# EAGLE design pulse (EAGLE 7.5.0)
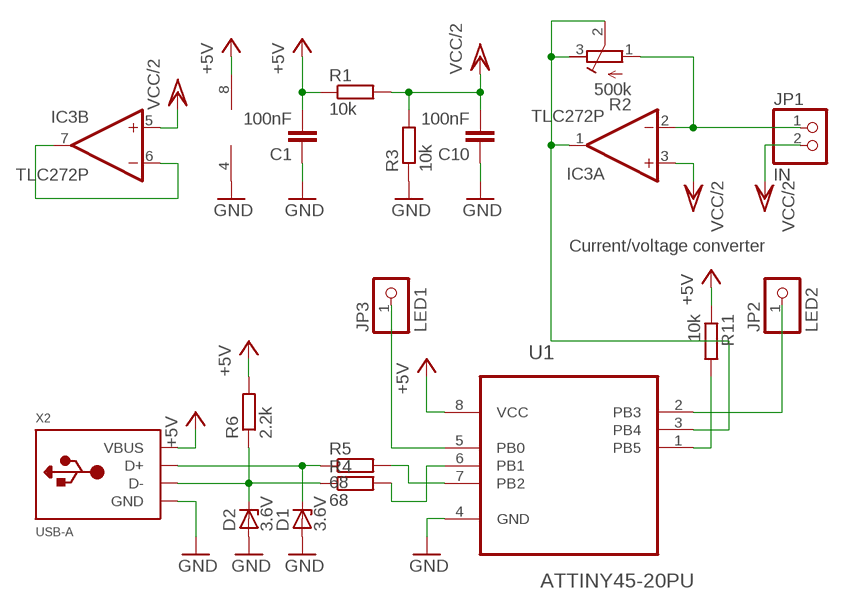
[diagram p0: schematic, sheet 1]

## Parts
C1  100nF  C-EU075-032X103  [C075-032X103]
C10  100nF  C-EU050-025X075  [C050-025X075]
D1  3.6V  ZENER-DIODEZD-2.5  [ZDIO-2.5]
D2  3.6V  ZENER-DIODEZD-5  [ZDIO-5]
IC3  TLC272P  [DIL08]
JP1  IN  PINHD-1X2  [1X02]
JP2  LED2  PINHD-1X1  [1X01]
JP3  LED1  PINHD-1X1  [1X01]
R1  10k  R-EU_0207/12  [0207/12]
R2  500k  R-TRIMM64W  [RTRIM64W]
R3  10k  R-EU_0204/2V  [0204V]
R4  68  R-EU_0204/2V  [0204V]
R5  68  R-EU_0204/2V  [0204V]
R6  2.2k  R-EU_0204/2V  [0204V]
R11  10k  R-EU_0204/7  [0204/7]
U1  ATTINY45-20PU  [DIP254P762X533-8]
X2  USB-A  [MOLEX_480371000]

## Nets
+5V: C1.2 IC3.8(P:V+) R1.1 R6.2 R11.1 U1.8(VCC) X2.1(VBUS)
GND: C1.1 C10.1 D1.A D2.A IC3.4(P:V-) R3.1 U1.4(GND) X2.4(GND)
N$1: IC3.2(A:-IN) JP1.1 R2.1(A)
N$2: R5.2 U1.7(PB2)
N$3: R4.2 U1.6(PB1)
N$4: JP2.1 U1.2(PB3)
N$5: JP3.1 U1.5(PB0)
N$7: IC3.6(B:-IN) IC3.7(B:OUT)
N$8: IC3.1(A:OUT) R2.2(S) R2.3(E) U1.3(PB4)
N$9: R11.2 U1.1(PB5)
N$10: D1.C R5.1 X2.3(D+)
N$11: D2.C R4.1 R6.1 X2.2(D-)
VCC/2: C10.2 IC3.3(A:+IN) IC3.5(B:+IN) JP1.2 R1.2 R3.2

## Notes on the sheet
- Current/voltage converter

## Library data of the parts
C1 C10 = rcl:C-EU: CAPACITOR, European symbol
D1 D2 = diode:ZENER-DIODE: Z-Diode
IC3 = linear:TLC272: OP AMP
JP1 = pinhead:PINHD-1X2: PIN HEADER
JP2 JP3 = pinhead:PINHD-1X1: PIN HEADER
R1 R3-R6 R11 = rcl:R-EU_: RESISTOR, European symbol
R2 = rcl:R-TRIMM: Trimm resistor
U1 = Atmel_By_element14_Batch_1-00:ATTINY45-20PU: 8-bit Microcontroller with 2/4/8KBytes In-System Programmable Flash; MPN: ATTINY45-20PU; OC_FARNELL: 1288352; OC_NEWARK: 23M5072; PACKAGE: PDIP-8; SUPPLIER: Atmel
X2 = adafruit:USB-A: USB type A 'plug' Used for things that can directly connect to a USB port, say USB key

## Board
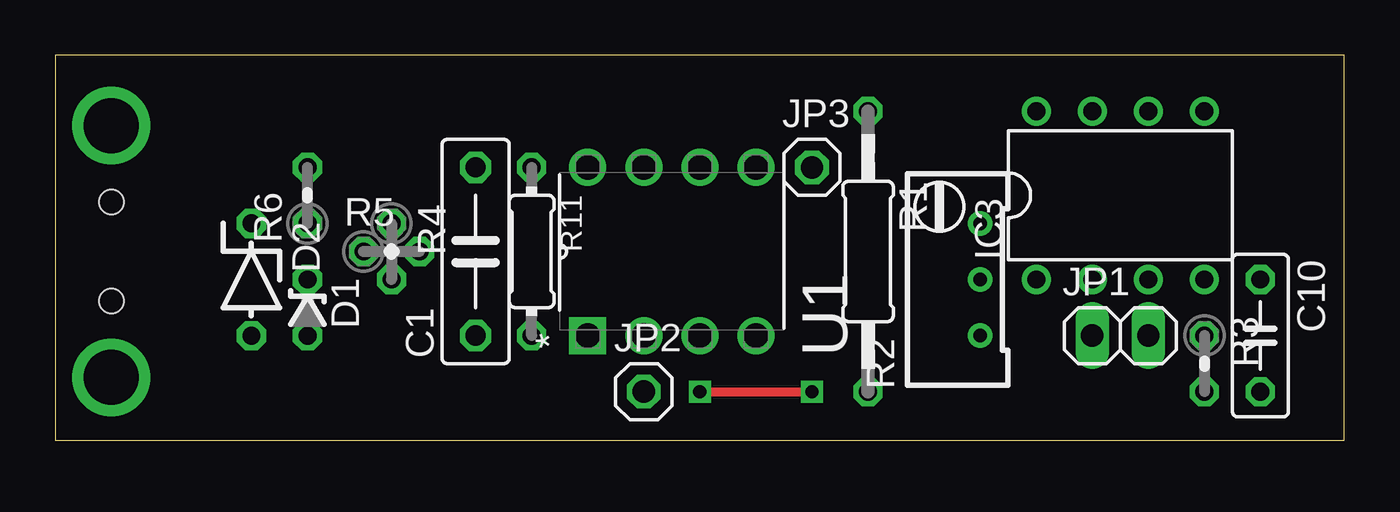
[diagram p1: board, top side]
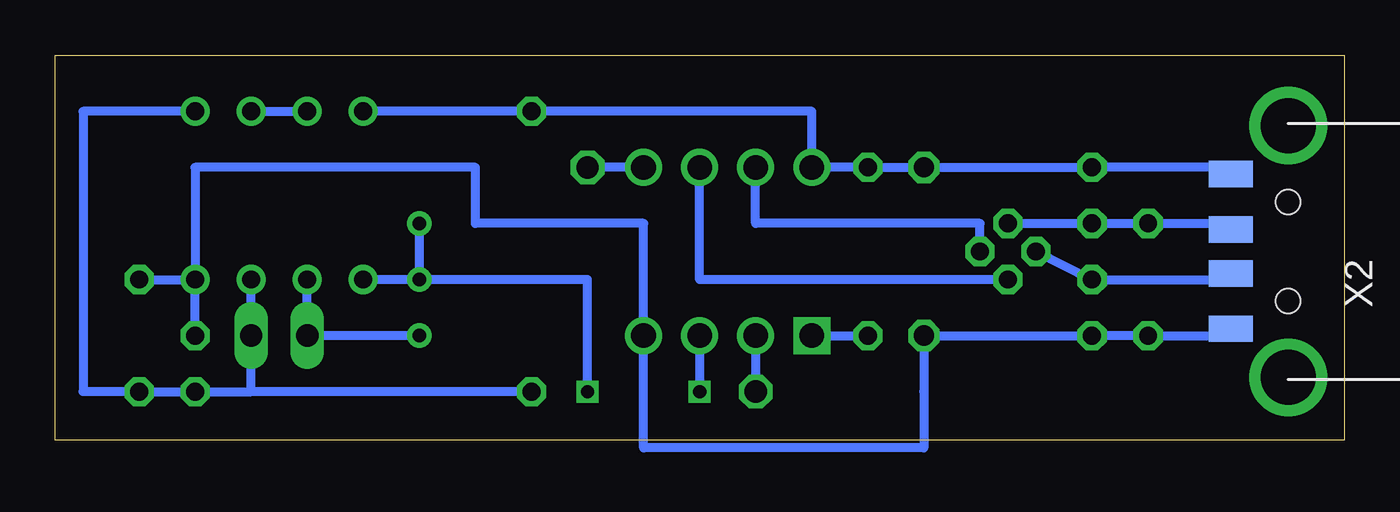
[diagram p2: board, bottom side, seen from below]

Size 58.41 x 17.45 mm. Coordinates in mm from the lower left corner, seen from the top.
Outline: 0,17.45 0,0 58.41,0 58.41,17.45 0,17.45
Copper layers (1*16): Top 0.035mm / dielectric 1.5mm / Bottom 0.035mm
Design rules "default": minimum track width 10mil, minimum drill 24mil, track to track 8mil, track to pad 8mil, pad to pad 8mil, via to via 8mil, smd to smd 8mil, copper to edge 40mil, drill to drill 8mil, minimum pad ring 10mil, minimum via ring 8mil, stop-mask expansion 4mil, vias tented up to drill 0mil, thermal gap 10mil

### Footprints (pad centres in the part's own frame; a part is rotated, then mirrored left to right if it is on the bottom)
C075-032X103 = drill 0.914 octagon: 1 -3.81,0; 2 3.81,0
C050-025X075 = drill 0.813 octagon: 1 -2.54,0; 2 2.54,0
ZDIO-2.5 = drill 0.813 octagon: A 1.27,0; C -1.27,0
ZDIO-5 = drill 0.813 octagon: A 2.54,0; C -2.54,0
DIL08 = drill 0.813 pad 1.27: 1 -3.81,-3.81; 2 -1.27,-3.81; 3 1.27,-3.81; 4 3.81,-3.81; 5 3.81,3.81; 6 1.27,3.81; 7 -1.27,3.81; 8 -3.81,3.81
1X02 = drill 1.016 long: 1 -1.27,0; 2 1.27,0
1X01 = drill 1.016 octagon: 1 0,0
0207/12 = drill 0.813 octagon: 1 -6.35,0; 2 6.35,0
RTRIM64W = drill 0.61: 1 1.27,-2.54; 2 1.27,0; 3 1.27,2.54
0204V = drill 0.813 octagon: 1 -1.27,0; 2 1.27,0
0204/7 = drill 0.813 octagon: 1 -3.81,0; 2 3.81,0
DIP254P762X533-8 = drill 1.118 square: 1 -7.62,7.62 | drill 1.118: 2 -7.62,5.08; 3 -7.62,2.54; 4 -7.62,0; 5 0,0; 6 0,2.54; 7 0,5.08; 8 0,7.62
MOLEX_480371000 = smd 1.2 x 2: 1 3.5,2.6; 2 1,2.6; 3 -1,2.6; 4 -3.5,2.6 | drill 2.5: M1 -5.7,0; M2 5.7,0 | hole 1.1: -2.25,0; 2.25,0

### Placement (x,y rotation side)
C1  19.05,8.56 90 top
C10  54.61,4.75 270 top
D1  11.43,6.02 270 top
D2  8.89,7.29 270 top
IC3  48.26,11.1 0 top
JP1  48.26,4.75 0 top
JP2  26.67,2.21 0 top
JP3  34.29,12.37 0 top
R1  36.83,8.56 270 top
R2  40.64,7.29 0 top
R3  52.07,3.48 270 top
R4  15.24,8.56 270 top
R5  15.24,8.56 0 top
R6  11.43,11.1 90 top
R11  21.59,8.56 270 top
U1  31.75,12.37 90 top
X2  2.54,8.56 90 bottom

### Tracks (layer width: path | path; a pad name or v marks a point on that pad's centre or on a via)
+5V
  Bottom 0.406: IC3.8 R1.1 24.13,14.91 U1.8 R11.1 C1.2 R6.2 5.08,12.37 5.08,12.06 X2.1
GND
  Bottom 0.406: C1.1 D1.A D2.A 5.14,4.75 X2.4 | C1.1 19.05,2.21 | R3.1 IC3.4 | C1.1 19.05,-0.33 31.75,-0.33 U1.4 31.75,9.83 39.37,9.83 39.37,12.37 52.07,12.37 IC3.4 | C10.1 IC3.4
N$1
  Bottom 0.406: IC3.2 JP1.1 R2.1
N$2
  Bottom 0.406: R5.2 16.51,9.83 26.67,9.83 U1.7
N$3
  Bottom 0.406: R4.2 29.21,7.29 U1.6
N$4
  Bottom 0.406: U1.2 JP2.1
N$5
  Bottom 0.406: U1.5 JP3.1
N$7
  Bottom 0.406: IC3.6 IC3.7
N$8  (via drill 0.6)
  Top 0.406: v29.21,2.21 v34.29,2.21
  Bottom 0.406: U1.3 v29.21,2.21 | R2.3 R2.2 | v34.29,2.21 34.29,7.29 R2.2 | R2.2 IC3.1
N$9
  Bottom 0.406: U1.1 R11.2
N$10
  Bottom 0.406: R5.1 D1.C 5.14,7.29 X2.3
N$11
  Bottom 0.406: R6.1 D2.C | R4.1 D2.C | D2.C 5.14,9.83 X2.2
VCC/2
  Bottom 0.406: R1.2 49.53,2.21 | 49.53,2.21 JP1.2 IC3.3 | IC3.5 57.15,14.91 57.15,2.21 C10.2 R3.2 49.53,2.21